# EAGLE design led-drv (EAGLE 8.7.1)
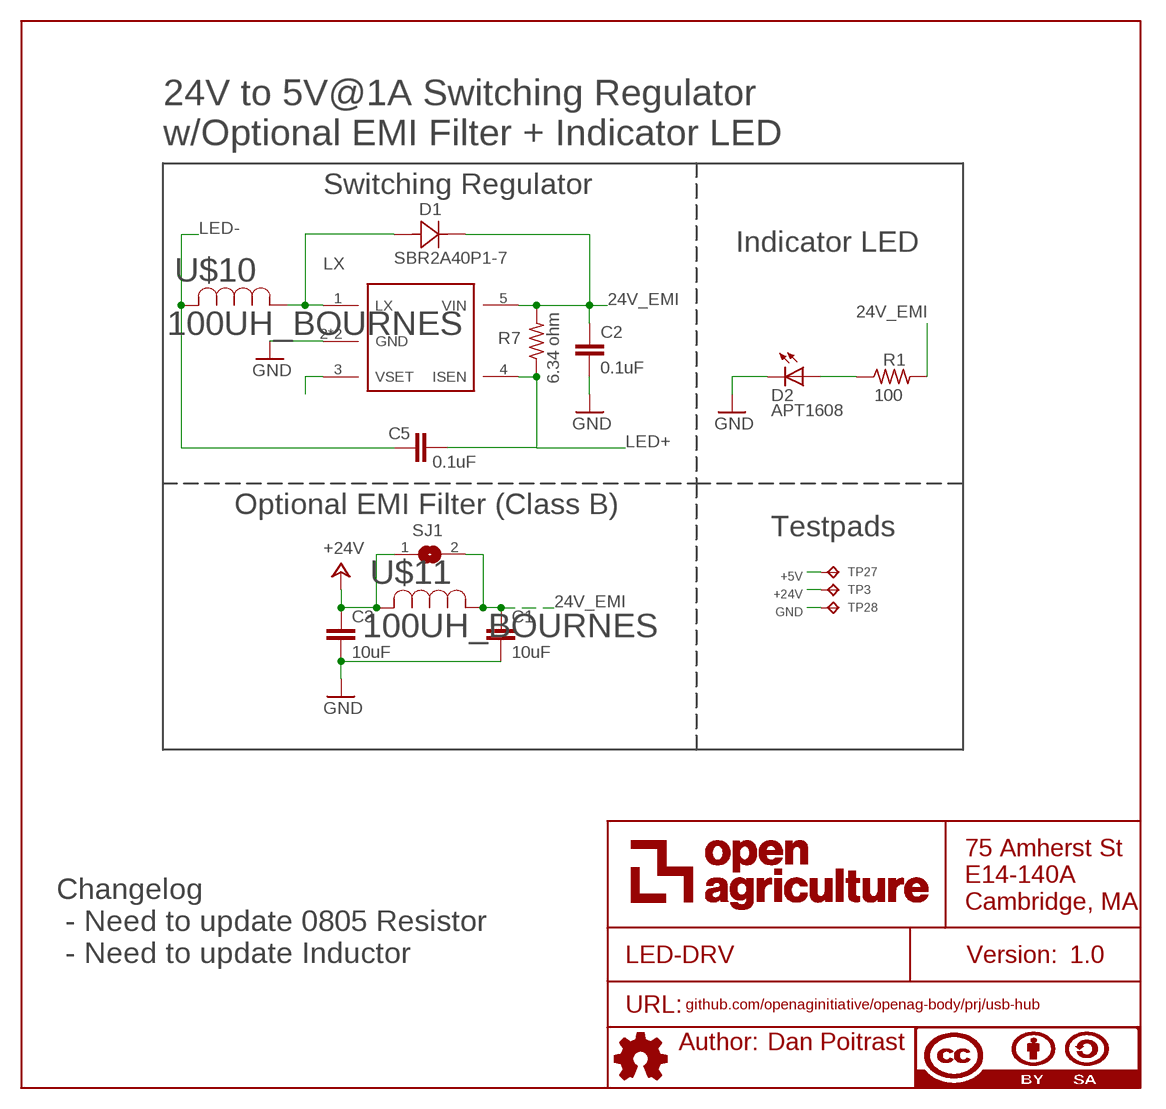
[diagram p0: schematic, sheet 1]

## Parts
C1  10uF  10UF-GMK212BBJ106KG-T  [C0805]
C2  0.1uF  0.1UF-C0603C104K5RACTU  [C0603]
C3  10uF  10UF-GMK212BBJ106KG-T  [C0805]
C5  0.1uF  0.1UF-C0603C104K5RACTU  [C0603]
D1  SBR2A40P1-7  [POWERDI123]
D2  APT1608  APT1608CGCK  [CHIPLED_0603]
R1  100  100OHM-RC0603JR-07100RL  [RC0603N]
R7  6.34 ohm  6.3OHM-RC0805FR-076R34L  [R0805]
SJ1  SOLDERJUMPERREFLOW_NOPASTE  [SJ1]
TP3  TPTP06R  [TP06R]
TP27  TPTP06R  [TP06R]
TP28  TPTP06R  [TP06R]
U$6  AUTHOR  [AUTHOR]
U$7  TITLE  [TITLE]
U$9  AL8861  [AL8861]
U$10  100UH_BOURNES  [IND_BOURNS_SDR1307]
U$11  100UH_BOURNES  [IND_BOURNS_SDR1307]

## Nets
24V_EMI: C1.1 C2.1 D1.- R1.2 R7.2 SJ1.2 U$9.5(VIN) U$11.1
+5V: TP27.TP
+24V: C3.1 SJ1.1 TP3.TP U$11.2
GND: C1.2 C2.2 C3.2 D2.C TP28.TP U$9.2(GND) U$9.44(GND)
LED+: C5.2 R7.1 U$9.4(ISEN)
LED-: C5.1 U$10.2
LX: D1.+ U$9.1(LX) U$10.1
N$6: D2.A R1.1
N$7: U$9.3(VSET)

## Notes on the sheet
- 24V to 5V@1A Switching Regulator
  w/Optional EMI Filter + Indicator LED
- Switching Regulator
- Indicator LED
- Optional EMI Filter (Class B)
- Testpads
- Changelog
   - Need to update 0805 Resistor
   - Need to update Inductor

## Library data of the parts
C1 C3 = openag-capacitors:10UF-GMK212BBJ106KG-T: CAP CER 10UF 35V X5R 0805 Description: 10µF ±10% 35V Ceramic Capacitor X5R 0805 (2012 Metric) Technical Specifications: Capacitance: 10µF Tolerance: ±10% Rated Voltage: 35V Temperature Coefficient: X5R Operating Temperature: -55°C ~ 85°C Package / Case: 0805 (2012 Metric) Datasheet(s): GMK212BBJ106KG-T Spec <http://ds.yuden.co.jp/TYCOMPAS/ut/detail.do?productNo=GMK212BBJ106KG-T&fileName=GMK212BBJ106KG-T_SS&mode=specSheetDownload> Vendor(s): Digikey: 587-4893-1-ND <https://www.digikey.com/product-detail/en/taiyo-yuden/GMK212BBJ106KG-T/587-4893-1-ND/6563736>; MANUFACTURER: Taiyo Yuden; MPN: GMK212BBJ106KG-T; VENDOR: Digikey; VLINK: https://www.digikey.com/product-detail/en/taiyo-yuden/GMK212BBJ106KG-T/587-4893-1-ND/6563736; VPN: 587-4893-1-ND
C2 C5 = openag-capacitors:0.1UF-C0603C104K5RACTU: CAP CER 0.1UF 50V X7R 0603 Description: 0.1µF ±10% 50V Ceramic Capacitor X7R 0603 (1608 Metric) Technical Specifications: Capacitance: 0.1µF Tolerance: ±10% Rated Voltage: 50V Temperature Coefficient: X7R Operating Temperature: -55°C ~ 125°C Package / Case: 0603 (1608 Metric) Datasheet(s): X7R Dielectric, 6.3-250 VDC <https://search.kemet.com/component-edge/download/datasheet/C0603C104K5RACTU.pdf> Vendor(s): Digikey: 399-5089-1-ND <https://www.digikey.com/product-detail/en/kemet/C0603C104K5RACTU/399-5089-1-ND/1465623>; MANUFACTURER: Kemet; MPN: C0603C104K5RACTU; VENDOR: Digikey; VLINK: https://www.digikey.com/product-detail/en/kemet/C0603C104K5RACTU/399-5089-1-ND/1465623; VPN: 399-5089-1-ND
D1 = openag-diodes:SBR2A40P1-7: DIODE SBR 40V 2A POWERDI123 Description: Diode Super Barrier 40V 2A Surface Mount PowerDI™ 123 Technical Specifications: Diode Type: Super Barrier Voltage - DC Reverse (Vr) (Max): 40V Current - Average Rectified (Io): 2A Voltage - Forward (Vf) (Max) @ If: 500mV @ 2A Speed: Standard Recovery >500ns, > 200mA (Io) Current - Reverse Leakage @ Vr: 100µA @ 40V Mounting Type: Surface Mount Package / Case: POWERDI®123 Supplier Device Package: PowerDI™ 123 Operating Temperature - Junction: -65°C ~ 150°C Base Part Number: SBR2A40 Datasheet(s): SBR2A40P1 <https://www.diodes.com/assets/Datasheets/SBR2A40P1.pdf> Vendor(s): Digikey: SBR2A40P1DITR-ND <https://www.digikey.com/product-detail/en/diodes-incorporated/SBR2A40P1-7/SBR2A40P1DITR-ND/1681825>; MANUFACTURER: Diodes Incorporated; MPN: SBR2A40P1-7; VENDOR: Digikey; VLINK: https://www.digikey.com/product-detail/en/diodes-incorporated/SBR2A40P1-7/SBR2A40P1DITR-ND/1681825; VPN: SBR2A40P1DITR-ND
D2 = openag-diodes:APT1608CGCK: LED GREEN CLEAR 0603 SMD Description: Green 570nm LED Indication - Discrete 2.1V 0603 (1608 Metric) Technical Specifications: Color: Green Lens Color: Colorless Lens Transparency: Clear Millicandela Rating: 50mcd Lens Style/Size: Rectangle with Flat Top, 1.20mm x 0.80mm Voltage - Forward (Vf) (Typ): 2.1V Current - Test: 20mA Viewing Angle: 120° Mounting Type: Surface Mount Wavelength - Dominant: 570nm Wavelength - Peak: 574nm Package / Case: 0603 (1608 Metric) Supplier Device Package: Chip LED Size / Dimension: 1.60mm L x 0.80mm W Height (Max): 0.75mm Datasheet(s): APT1608CGCK <http://www.kingbrightusa.com/images/catalog/SPEC/APT1608CGCK.pdf> Vendor(s): Digikey: 754-1116-1-ND <https://www.digikey.com/product-detail/en/kingbright/APT1608CGCK/754-1116-1-ND/1747833#>; MANUFACTURER: Kingbright; MPN: APT1608CGCK; VENDOR: Digikey; VLINK: https://www.digikey.com/product-detail/en/kingbright/APT1608CGCK/754-1116-1-ND/1747833#; VPN: 754-1116-1-ND
R1 = openag-resistors:100OHM-RC0603JR-07100RL: RES SMD 100 OHM 5% 1/10W 0603 Description: 100 Ohms ±5% 0.1W, 1/10W Chip Resistor 0603 (1608 Metric) Moisture Resistant Thick Film Technical Specifications: Resistance: 100 Ohms Tolerance: ±5% Power (Watts): 0.1W, 1/10W Composition: Thick Film Features: Moisture Resistant Temperature Coefficient: ±100ppm/°C Operating Temperature: -55°C ~ 155°C Package / Case: 0603 (1608 Metric) Supplier Device Package: 0603 Size / Dimension: 0.063" L x 0.032" W (1.60mm x 0.80mm) Height - Seated (Max): 0.022" (0.55mm) Number of Terminations: 2 Datasheet(s): Thick Film Chip Resistor Intro <http://www.yageo.com.tw/exep/pages/download/literatures/PYu-R_INT-thick_7.pdf> Chip Resistor Marking <http://www.yageo.com/exep/pages/download/literatures/PYu-R_Marking_2.pdf> RC Series, L Datasheet <http://www.yageo.com/documents/recent/PYu-RC_Group_51_RoHS_L_8.pdf> Vendor(s): Digikey: 311-100GRCT-ND <https://www.digikey.com/product-detail/en/yageo/RC0603JR-07100RL/311-100GRCT-ND/729644>; MANUFACTURER: Yageo; MPN: RC0603JR-07100RL; VENDOR: Digikey; VLINK: https://www.digikey.com/product-detail/en/yageo/RC0603JR-07100RL/311-100GRCT-ND/729644; VPN: 311-100GRCT-ND
R7 = openag-resistors:6.3OHM-RC0805FR-076R34L: Yageo - RC0805FR-076R34L - RES SMD 6.34 OHM 1% 1/8W 0805 Description: 6.34 Ohms ±1% 0.125W, 1/8W Chip Resistor 0805 (2012 Metric) Moisture Resistant Thick Film Technical Specifications: Resistance: 6.34 Ohms Tolerance: ±1% Power: 0.125W, 1/8W Temperature Coefficient: ±200ppm/°C Operating Temperature: -55°C ~ 155°C Packaging / Case: 0805 (2012 Metric) Datasheet(s): RC Series, L Datasheet Vendor(s): Digikey: 311-6.34CRCT-ND <https://www.digikey.com/product-detail/en/yageo/RC0805FR-076R34L/311-6.34CRCT-ND/731003>; POPULATE: YES; VERIFIED: NO
SJ1 = openag-connectors:SOLDERJUMPER: SMD Solder JUMPER Solder the two pads together to create a connection, or remove the solder to break it. REFLOW - Use this footprint for solder paste and reflow ovens. WAVE - Use this footprint for hand-soldering (larger pads). CLOSED - Has a trace between the two pads to ensure it is closed by default. The trace needs to be cut to disable the jumper, and can be closed again by creating a solder bridge between the two pads.; MPN: N/A
TP3 TP27 TP28 = openag-testpads:TP: Test pad; MPN: N/A
U$6 = openag-frames:AUTHOR; AUTHOR: Dan Poitrast; MPN: N/A
U$7 = openag-frames:TITLE; MPN: N/A; TITLE: LED-DRV; URL: github.com/openaginitiative/openag-body/prj/usb-hub; VER: 1.0
U$9 = openag-driver-IC:AL8861: AL8861 LED Driver IC Description: IC LED DRVR REG PWM 1.5A SOT89-5 Technical Specifications: Type: IC Voltage In: 4.5V - 40V Current Out: Up to 1.5A Frequency: 1Mhz Dimming: PWM or Analog Package SOT-89-5 Operating Temperature: -40°C ~ 85°C (TA) Datasheet(s): Diodes AL8861 <https://www.mouser.com/ds/2/115/AL8861-1094677.pdf> Vendor(s): Digikey: Diodes AL8861 <https://www.digikey.com/product-detail/en/diodes-incorporated/AL8861Y-13/AL8861Y-13DICT-ND/6702378>
U$10 U$11 = openag-inductors:100UH_BOURNES: Bourne - FIXED IND 100UH 1.9A 180 MOHM Technical Specifications: Inductance: 100uH Rated Current: 1.9A Saturation Current: 3.0A DC Resistance: 180mΩ Operating Temperature: -40° C to 125°C Datasheet(s): 100uH Bourne <http://www.bourns.com/docs/Product-Datasheets/SDR1307.pdf> Vendors: Digikey: SDR1307-101KLCT-ND <https://www.digikey.com/product-detail/en/bourns-inc/SDR1307-101KL/SDR1307-101KLCT-ND/3437739>

## Board
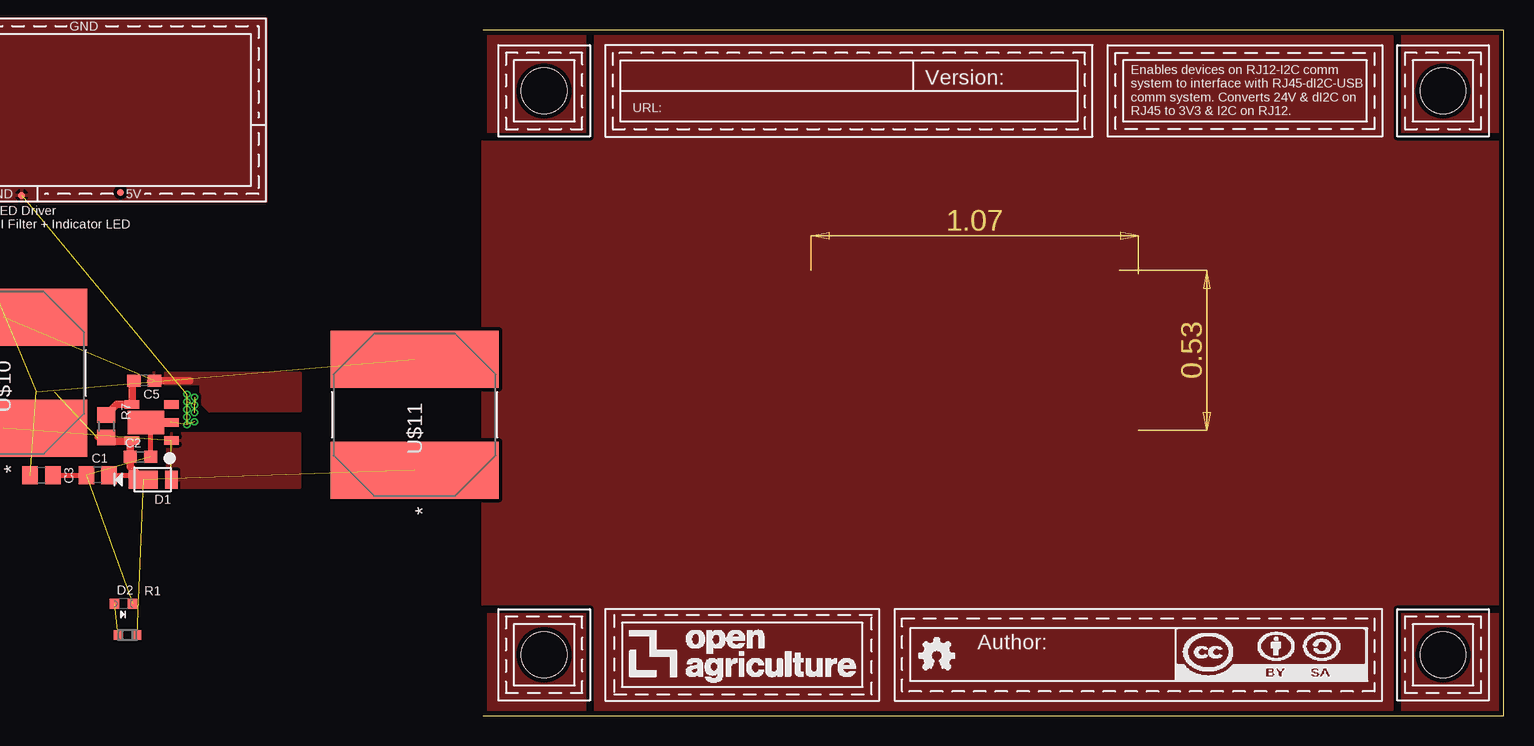
[diagram p1: board, top side]
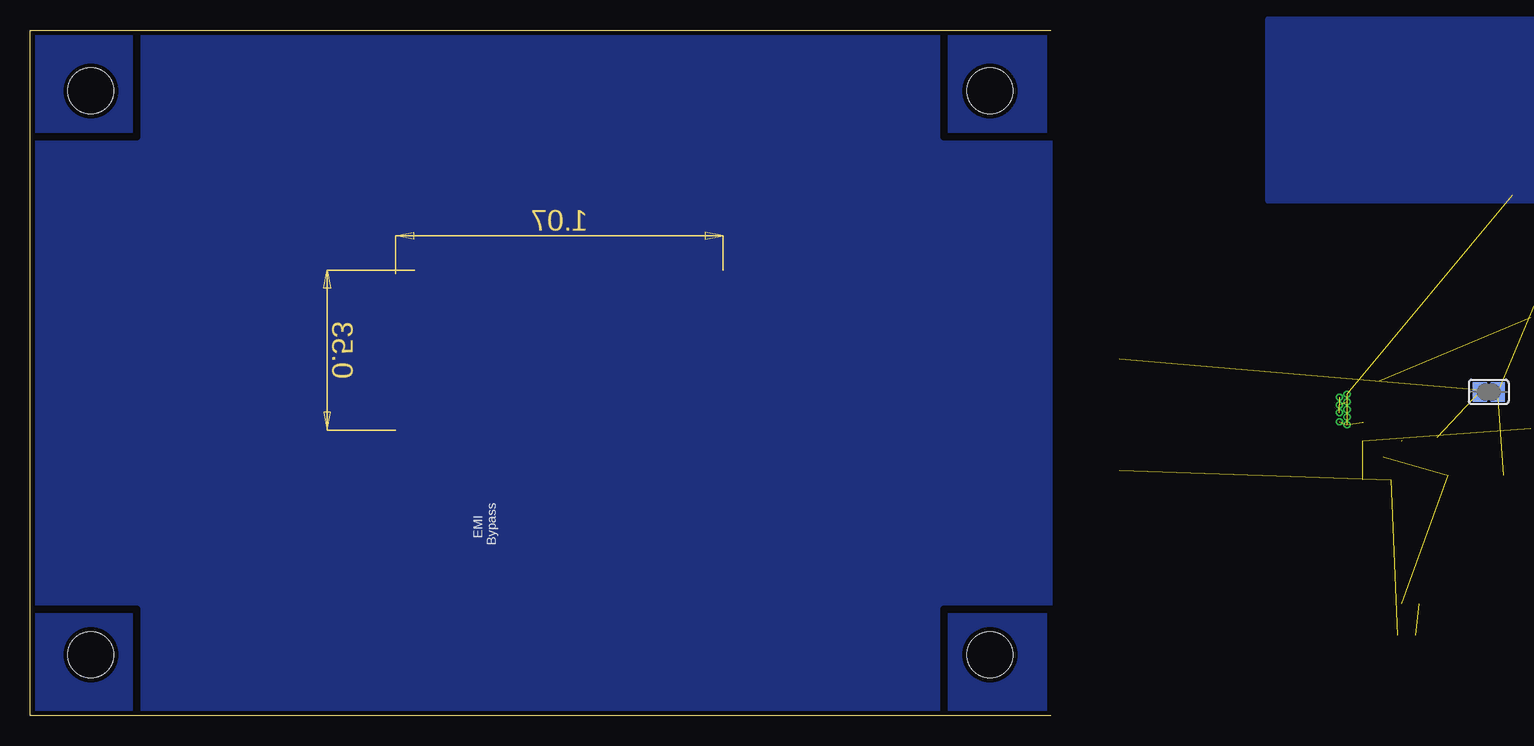
[diagram p2: board, bottom side, seen from below]

Size 85.09 x 57.15 mm. Coordinates in mm from the lower left corner, seen from the top.
Outline: 0,0 85.09,0 85.09,57.15 0,57.15
Copper layers (1*16): Top 0.035559375mm / dielectric 1.6mm / Bottom 0.035559375mm
Design rules "oshpark-2layer-mask": minimum track width 6mil, minimum drill 10mil, track to track 6mil, track to pad 6mil, pad to pad 6mil, via to via 6mil, smd to smd 6mil, copper to edge 15mil, drill to drill 6mil, minimum pad ring 5mil, minimum via ring 5mil, stop-mask expansion 2.5mil, vias tented up to drill 20mil, thermal gap 10mil
tRestrict: 2 lines
Milling: area 27.3,39.7 to 28.8,40.3; area 53.1,39.7 to 54.6,40.3; area 38.2,40.4 to 43.7,42.2; area 60,23.8 to 60.6,25.3; area 60,35.6 to 60.6,37.1; area 58.1,27.7 to 59.9,33.3; 6 lines

### Footprints (pad centres in the part's own frame; a part is rotated, then mirrored left to right if it is on the bottom)
C0805 = smd 1.3 x 1.5: 1 -0.95,0; 2 0.95,0
C0603 = smd 1.1 x 1: 1 -0.85,0; 2 0.85,0
POWERDI123 = smd 1.05 x 1.5: + -1.3,0 | smd 2.4 x 1.5: - 1.05,0
CHIPLED_0603 = smd 0.8 x 0.8: A 0,-0.75; C 0,0.75
RC0603N = smd 0.756 x 0.8: 1 -0.778,0; 2 0.778,0
R0805 = smd 1.3 x 1.5: 1 -0.95,0; 2 0.95,0
SJ1 = smd 1.168 x 1.6: 1 -0.762,0; 2 0.762,0
TP06R = smd 0.6 x 0.6: TP 0,0
CORNER = hole 3.81: 0,0
AL8861 = smd 0.68 x 1.2: 1 -1.5,-1.65; 2 0,-1.65; 3 1.5,-1.65; 4 1.5,1.65; 5 -1.5,1.65 | smd 1.93 x 3.05: 44 0,0.475
IND_BOURNS_SDR1307 = smd 4.75 x 13.995: 1 -4.623,0; 2 4.623,0

### Placement (x,y rotation side)
C1  -32.13,20.07 180 top  (outside the outline)
C2  -28.57,21.59 0 top  (outside the outline)
C3  -36.83,20.07 0 top  (outside the outline)
C5  -28.26,27.94 180 top  (outside the outline)
D1  -27.3,19.68 180 top  (outside the outline)
D2  -29.97,9.33 270 top  (outside the outline)
R1  -29.65,6.73 0 top  (outside the outline)
R7  -31.43,24.13 270 top  (outside the outline)
SJ1  -36.51,26.99 180 bottom  (outside the outline)
TP3  -46.67,49.47 270 top  (outside the outline)
TP27  -30.23,43.62 270 top  (outside the outline)
TP28  -38.48,43.37 270 top  (outside the outline)
U$1  [CORNER]  5.08,5.08 0 top
U$2  [CORNER]  5.08,52.07 270 top
U$3  [CORNER]  80.01,52.07 180 top
U$4  [CORNER]  80.01,5.08 90 top
U$5  [LOGO]  10.16,1.27 0 top
U$6  34.29,1.27 0 top
U$7  10.16,48.26 0 top
U$9  -27.62,24.45 90 top  (outside the outline)
U$10  -40.01,28.57 90 top  (outside the outline)
U$11  -5.71,25.08 90 top  (outside the outline)

### Tracks (layer width: path | path; a pad name or v marks a point on that pad's centre or on a via)
24V_EMI  (4 unrouted)
  Top 0.406: -32.18,23.18 R7.2 | C1.1 -28.74,20.07 -28.62,19.95
  Top 0.61: R7.2 -31.11,22.86 -29.21,22.86 -29.43,22.64 C2.1 -29.43,20.75 -28.62,19.95 D1.-
+24V  (3 unrouted)
  pour Top (isolate 0.406): -43.5,42.86 -47.31,42.86 -47.31,58.1 -43.5,58.1
GND  (via drill 0.35)  (13 unrouted)
  Top 0.406: C3.2 C1.2 | C2.2 -27.73,24.07 U$9.44 -26.04,24.45
  other vias: -24.7,24.26 -24.07,24.51 -24.7,24.89 -24.07,25.27 -24.07,25.91 -24.7,25.53 -24.7,26.16 -24.07,26.54 -24.7,26.8
  pour Top (isolate 0.305, rank 3): 0,0 85.09,0 85.09,57.15 0,57.15
  pour Bottom (isolate 0.305, rank 3): 0,0 85.09,0 85.09,57.15 0,57.15
  pour Top (isolate 0.305, rank 2): -18.1,42.86 -47.31,42.86 -47.31,58.1 -18.1,58.1
  pour Bottom (isolate 0.406, rank 2): -18.1,58.1 -47.31,58.1 -47.31,42.86 -18.1,42.86
LED+
  Top 0.61: R7.1 -30.57,25.95 U$9.4 -29.27,27.77 C5.2
LED-  (1 unrouted)
  Top 0.61: -24.45,27.94 C5.1
  pour Top (isolate 0.254): -15.24,25.4 -22.86,25.4 -23.5,26.04 -23.5,27.62 -27.94,27.62 -27.94,28.57 -15.24,28.57
LX  (2 unrouted)
  Top 0.61: -26,22.91 U$9.1
  pour Top (isolate 0.254): -15.24,23.5 -26.04,23.5 -26.35,23.18 -26.35,19.05 -15.24,19.05
N$6  (1 unrouted)

### Text on the board
tPlace: GND | 24V | Enables devices on RJ12-I2C comm / system to interface with RJ45-dI2C-USB / comm system. Converts 24V & dI2C on / RJ45 to 3V3 & I2C on RJ12. | GND | 5V | 4.5-40V 1.5A LED Driver / w/Optional EMI Filter + Indicator LED
bPlace: EMI / Bypass